# Altium schematic sheet Power_system.SchDoc
size A4; SheetNumber: 1; SheetTotal: 3
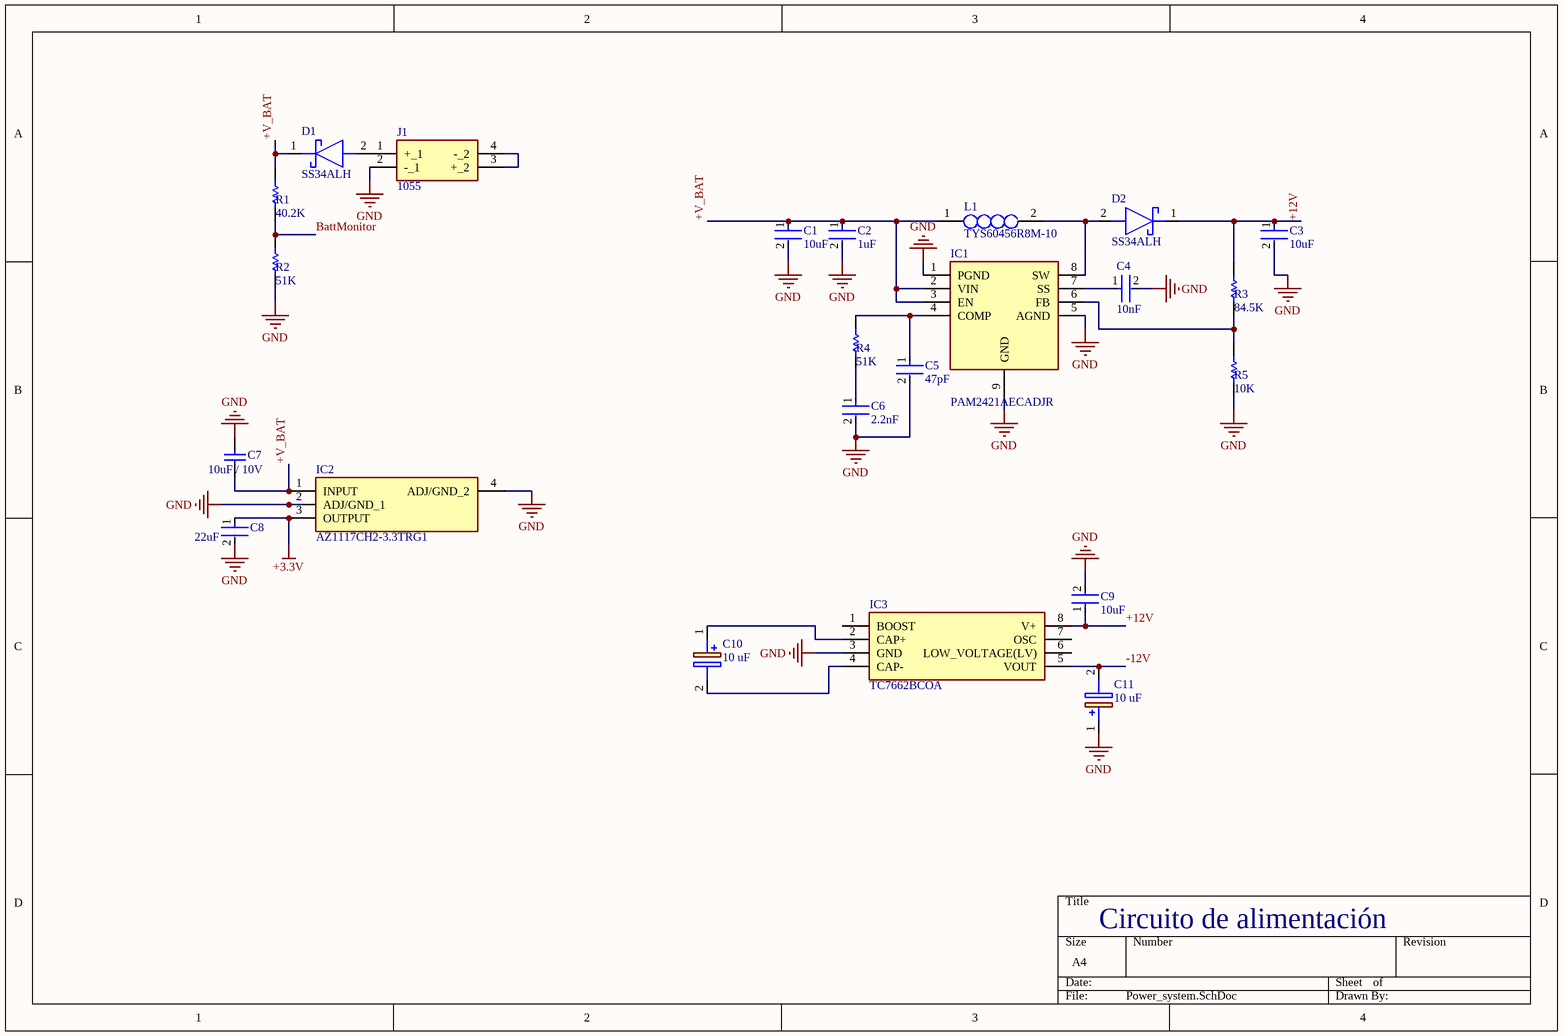
[diagram p0: Power_system.SchDoc]

## Parts
C1  10uF  [FP-GRM188-0_2-MFG]
C2  1uF  [FP-GRM188-0_2-MFG]
C3  10uF  [FP-GRM188-0_2-MFG]
C4  10nF  [FP-GRM188-0_2-MFG]
C5  47pF  [FP-GRM188-0_2-MFG]
C6  2.2nF  [FP-GRM188-0_2-MFG]
C7  10uF / 10V  [CAPC1608X90X35LL15T15]
C8  22uF  [FP-GRM188-0_2-MFG]
C9  10uF  [FP-GRM188-0_2-MFG]
C10  10 uF  [CAPAE430X550N]
C11  10 uF  [CAPAE430X550N]
D1  SS34ALH  [SODFL5226X100N]
D2  SS34ALH  [SODFL5226X100N]
IC1  PAM2421AECADJR  [SOIC127P600X150-9N]
IC2  AZ1117CH2-3.3TRG1  [SOT230P700X180-4N]
IC3  TC7662BCOA  [SOIC127P600X175-8N]
J1  1055  [1055]
L1  TYS60456R8M-10  [INDPM6060X470N]
R1  40.2K  [RESC1608X55X30ML20T20]
R2  51K  [RESC1608X55X30ML20T20]
R3  84.5K  [RESC1608X55X30ML20T20]
R4  51K  [RESC1608X55X30ML20T20]
R5  10K  [RESC1608X55X30ML20T20]

## Nets
+3.3V: C8.1 IC2.3(OUTPUT)
GND: C1.2 C2.2 C3.2 C4.2 C5.2 C6.2 C7.1 C8.2 C9.2 C11.1(+) IC1.1(PGND) IC1.5(AGND) IC1.9(GND) IC2.2(ADJ/GND_1) IC2.4(ADJ/GND_2) IC3.3(GND) J1.2(-_1) R2.1 R5.1
+12V: C3.1 C9.1 D2.1(K) IC3.8(V+) R3.2
+V_BAT: C1.1 C2.1 C7.2 D1.1(K) IC1.2(VIN) IC1.3(EN) IC2.1(INPUT) L1.1 R1.2
-12V: C11.2(-) IC3.5(VOUT)
BattMonitor: R1.1 R2.2
NetC4_1: C4.1 IC1.7(SS)
NetC5_1: C5.1 IC1.4(COMP) R4.2
NetC6_1: C6.1 R4.1
NetC10_1: C10.1(+) IC3.2(CAP+)
NetC10_2: C10.2(-) IC3.4(CAP-)
NetD1_2: D1.2(A) J1.1(+_1)
NetD2_2: D2.2(A) IC1.8(SW) L1.2
NetIC1_6: IC1.6(FB) R3.1 R5.2
NetJ1_3: J1.3(+_2) J1.4(-_2)

Not connected (* = marked no-connect by the designer): IC3 1(BOOST) 6(LOW_VOLTAGE(LV)) 7(OSC)

## Notes on the sheet
- Circuito de alimentación

## Library data of the parts
C1-C6 C8 C9 = CMP-2006-02788-2: Chip Multilayer Ceramic Capacitors for General Purpose, 0603, 22uF, X5R, 15%, 20%, 4V; Case/Package: 0603; Package Quantity: 4000; Lead Free: Lead Free; Material: Ceramic; Height: 0.8mm; Length: 1.6mm; REACH SVHC: No SVHC; Voltage Rating: 4V; Depth: 0.8mm; Case Code (Metric): 1608; Voltage: 4V; Dielectric: X5R; Width: 0.8mm; Max Operating Temperature: 85°C; Tolerance: 20%; Packaging: Tape and Reel; Case Code (Imperial): 0603; Voltage Rating (DC): 4V; Thickness: 0.035inch; Mount: Surface Mount; Min Operating Temperature: -55°C; Radiation Hardening: No; Capacitance: 22uF; Termination: SMD/SMT
C7 = CMP-2006-02241-1: Part Number: C0603C105K9PACTU; Manufacturer: Kemet
C10 C11 = 865080340001: Capacitor Polarised; Manufacturer_Name: Wurth Elektronik; Datasheet Link: https://componentsearchengine.com/Datasheets/1/865080340001.pdf; Height: 5.5mm; Manufacturer_Part_Number: 865080340001; Mouser Part Number: 710-865080340001; Mouser Price/Stock: https://www.mouser.co.uk/ProductDetail/Wurth-Elektronik/865080340001?qs=0KOYDY2FL2%252BaqRFD837lAw%3D%3D
D1 D2 = SS34ALH: Schottky Diode; Manufacturer_Name: Taiwan Semiconductor; Datasheet Link: https://services.ts.com.tw/storage/resources/datasheet/SS34ALH%20SERIES_B2103.pdf; Height: 1mm; Manufacturer_Part_Number: SS34ALH; Mouser Part Number: 821-SS34ALH; Mouser Price/Stock: https://www.mouser.co.uk/ProductDetail/Taiwan-Semiconductor/SS34ALH?qs=A6eO%252BMLsxmQip%2FrgNup6RA%3D%3D; Arrow Part Number: SS34ALH; Arrow Price/Stock: https://www.arrow.com/en/products/ss34alh/taiwan-semiconductor?region=nac
IC1 = PAM2421AECADJR: Integrated Circuit; Manufacturer_Name: Diodes Incorporated; Datasheet Link: https://www.diodes.com/assets/Datasheets/products_inactive_data/PAM2421_22_23.pdf; Height: 1.5mm; Manufacturer_Part_Number: PAM2421AECADJR; Mouser Part Number: 621-PAM2421AECADJR; Mouser Price/Stock: https://www.mouser.co.uk/ProductDetail/Diodes-Incorporated/PAM2421AECADJR?qs=pYVYkI7xuRVOhRU6vAk7Ag%3D%3D; Arrow Part Number: PAM2421AECADJR; Arrow Price/Stock: https://www.arrow.com/en/products/pam2421aecadjr/diodes-incorporated?region=nac
IC2 = AZ1117CH2-3.3TRG1: Integrated Circuit; Manufacturer_Name: Diodes Incorporated; Datasheet Link: https://www.arrow.com/en/products/az1117ch2-3.3trg1/diodes-incorporated; Height: 1.8mm; Manufacturer_Part_Number: AZ1117CH2-3.3TRG1; Mouser Part Number: 621-AZ1117CH2-33TRG1; Mouser Price/Stock: https://www.mouser.co.uk/ProductDetail/Diodes-Incorporated/AZ1117CH2-3.3TRG1?qs=lQAVKuKFhkLc7jCxso2G3w%3D%3D; Arrow Part Number: AZ1117CH2-3.3TRG1; Arrow Price/Stock: https://www.arrow.com/en/products/az1117ch2-3.3trg1/diodes-incorporated?region=nac
IC3 = TC7662BCOA: Integrated Circuit; Manufacturer_Name: Microchip; Datasheet Link: https://datasheet.datasheetarchive.com/originals/distributors/Datasheets-19/DSA-360076.pdf; Height: 1.75mm; Manufacturer_Part_Number: TC7662BCOA; Mouser Part Number: 579-TC7662BCOA; Mouser Price/Stock: https://www.mouser.co.uk/ProductDetail/Microchip-Technology/TC7662BCOA?qs=MvcPkWSywoxVMnnd8pEw8w%3D%3D; Arrow Part Number: TC7662BCOA; Arrow Price/Stock: https://www.arrow.com/en/products/tc7662bcoa/microchip-technology?region=nac
J1 = 1055: Connector; Manufacturer_Name: Keystone Electronics; Datasheet Link: https://www.keyelco.com/product-pdf.cfm?p=14065; Height: 15.48mm; Manufacturer_Part_Number: 1055; Mouser Part Number: 534-1055; Mouser Price/Stock: https://www.mouser.co.uk/ProductDetail/Keystone-Electronics/1055?qs=OkugU0Onrk3ye42txSrmZg%3D%3D
L1 = TYS60456R8M-10: Inductor; Manufacturer_Name: Laird Performance Materials; Datasheet Link: https://componentsearchengine.com/Datasheets/1/TYS60456R8M-10.pdf; Height: 4.7mm; Manufacturer_Part_Number: TYS60456R8M-10; Mouser Part Number: 875-TYS60456R8M-10; Mouser Price/Stock: https://www.mouser.co.uk/ProductDetail/Laird-Performance-Materials/TYS60456R8M-10?qs=HVbQlW5zcXUG%252BgroF%2F21Tw%3D%3D
R1-R5 = CMP-2000-00041-1: Part Number: ERA3AEB333V; Manufacturer: Panasonic